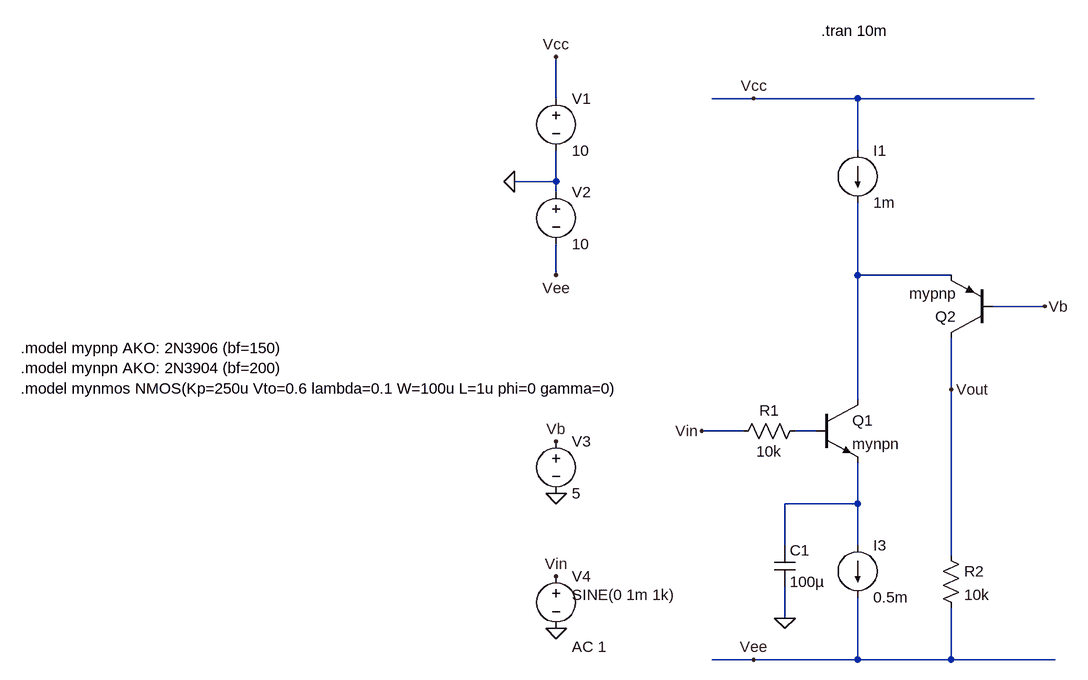
[diagram p0: schematic simple_folded_cascode.asc]
simple_folded_cascode.asc, the LTspice schematic file:
Version 4.1
SHEET 1 2252 1320
WIRE 80 368 80 304
WIRE 384 368 320 368
WIRE 544 368 384 368
WIRE 816 368 544 368
WIRE 544 448 544 368
WIRE 80 496 80 448
WIRE 80 496 16 496
WIRE 80 512 80 496
WIRE 80 640 80 592
WIRE 544 640 544 528
WIRE 688 640 544 640
WIRE 832 688 752 688
WIRE 688 816 688 736
WIRE 544 832 544 640
WIRE 368 880 304 880
WIRE 480 880 448 880
WIRE 544 992 544 928
WIRE 544 992 432 992
WIRE 432 1056 432 992
WIRE 544 1056 544 992
WIRE 688 1072 688 816
WIRE 432 1168 432 1120
WIRE 384 1232 320 1232
WIRE 544 1232 544 1136
WIRE 544 1232 384 1232
WIRE 688 1232 688 1152
WIRE 688 1232 544 1232
WIRE 848 1232 688 1232
FLAG 80 304 Vcc
FLAG 80 640 Vee
FLAG 80 976 0
FLAG 80 896 Vb
FLAG 16 496 0
FLAG 80 1184 0
FLAG 80 1104 Vin
FLAG 304 880 Vin
FLAG 832 688 Vb
FLAG 688 816 Vout
FLAG 384 368 Vcc
FLAG 384 1232 Vee
FLAG 432 1168 0
SYMBOL voltage 80 352 R0
SYMATTR InstName V1
SYMATTR Value 10
SYMBOL voltage 80 496 R0
SYMATTR InstName V2
SYMATTR Value 10
SYMBOL voltage 80 880 R0
WINDOW 123 0 0 Left 0
WINDOW 39 0 0 Left 0
SYMATTR InstName V3
SYMATTR Value 5
SYMBOL voltage 80 1088 R0
WINDOW 123 24 124 Left 2
WINDOW 39 0 0 Left 0
WINDOW 3 24 44 Left 2
SYMATTR Value2 AC 1
SYMATTR Value SINE(0 1m 1k)
SYMATTR InstName V4
SYMBOL npn 480 832 R0
SYMATTR InstName Q1
SYMATTR Value mynpn
SYMBOL pnp 752 736 R180
SYMATTR InstName Q2
SYMATTR Value mypnp
SYMBOL current 544 448 R0
SYMATTR InstName I1
SYMATTR Value 1m
SYMBOL res 464 864 R90
WINDOW 0 0 56 VBottom 2
WINDOW 3 32 56 VTop 2
SYMATTR InstName R1
SYMATTR Value 10k
SYMBOL res 672 1056 R0
SYMATTR InstName R2
SYMATTR Value 10k
SYMBOL cap 416 1056 R0
SYMATTR InstName C1
SYMATTR Value 100µ
SYMBOL current 544 1056 R0
SYMATTR InstName I3
SYMATTR Value 0.5m
TEXT 488 264 Left 2 !.tran 10m
TEXT -744 752 Left 2 !.model mypnp AKO: 2N3906 (bf=150)\n.model mynpn AKO: 2N3904 (bf=200)\n.model mynmos NMOS(Kp=250u Vto=0.6 lambda=0.1 W=100u L=1u phi=0 gamma=0)

The netlist it stands for:
* simple_folded_cascode.asc
V1 Vcc 0 10
V2 0 Vee 10
V3 Vb 0 5
V4 Vin 0 SINE(0 1m 1k) AC 1
Q1 N001 N002 N003 0 mynpn
Q2 Vout Vb N001 0 mypnp
I1 Vcc N001 1m
R1 N002 Vin 10k
R2 Vout Vee 10k
C1 N003 0 100µ
I3 N003 Vee 0.5m
.model NPN NPN
.model PNP PNP
.lib standard.bjt
.tran 10m
.model mypnp AKO: 2N3906 (bf=150)
.model mynpn AKO: 2N3904 (bf=200)
.model mynmos NMOS(Kp=250u Vto=0.6 lambda=0.1 W=100u L=1u phi=0 gamma=0)
.backanno
.end